# EAGLE design battery (EAGLE 5.06)
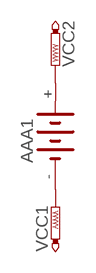
[diagram p0: schematic, sheet 1]

## Parts
AAA1  AAAAAASMT  [AAASMT]
VCC1  PTR1PAD1-13Y  [P1-13Y]
VCC2  PTR1PAD1-13Y  [P1-13Y]

## Nets
N$1: AAA1.+ VCC2.1(TP)
N$2: AAA1.- VCC1.1(TP)

## Library data of the parts
AAA1 = CEDTv14:AAA
VCC1 VCC2 = testpad:PTR1: TEST PIN

## Board
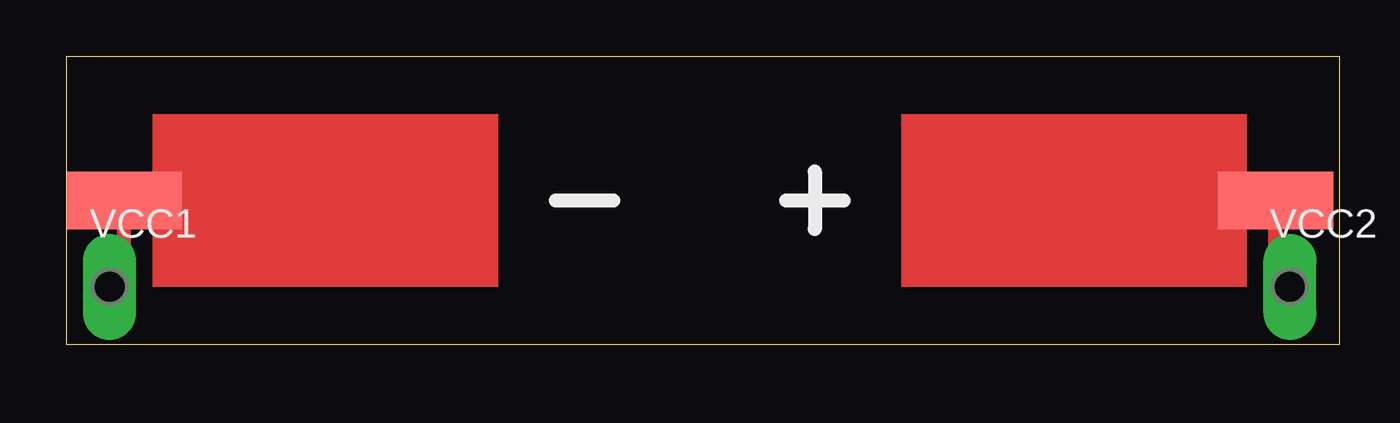
[diagram p1: board, top side]

Size 56.19 x 12.69 mm. Coordinates in mm from the lower left corner, seen from the top.
Outline: 0,0 56.19,0 56.19,12.69 0,12.69 0,0
Copper layers (1*16): Top 0.035mm / dielectric 1.5mm / Bottom 0.035mm
Design rules "default *": minimum track width 24mil, minimum drill 24mil, track to track 20mil, track to pad 20mil, pad to pad 20mil, via to via 20mil, smd to smd 20mil, copper to edge 40mil, drill to drill 8mil, minimum pad ring 20mil, minimum via ring 20mil, stop-mask expansion 4mil, vias tented up to drill 0mil, thermal gap 10mil

### Footprints (pad centres in the part's own frame; a part is rotated, then mirrored left to right if it is on the bottom)
AAASMT = smd 5.08 x 2.54: + 53.34,0; - 2.54,0
P1-13Y = drill 1.321 pad 1.905 long: 1 0,0

### Placement (x,y rotation side)
AAA1  0,6.35 0 top
VCC1  1.91,2.54 0 top
VCC2  53.98,2.54 0 top

### Tracks (layer width: path | path; a pad name or v marks a point on that pad's centre or on a via)
N$1
  Top 0.61: AAA1.+ 53.34,2.54 VCC2.1
N$2
  Top 0.61: AAA1.- 2.54,2.54 VCC1.1